# Altium project Puisance propre.PrjPcb
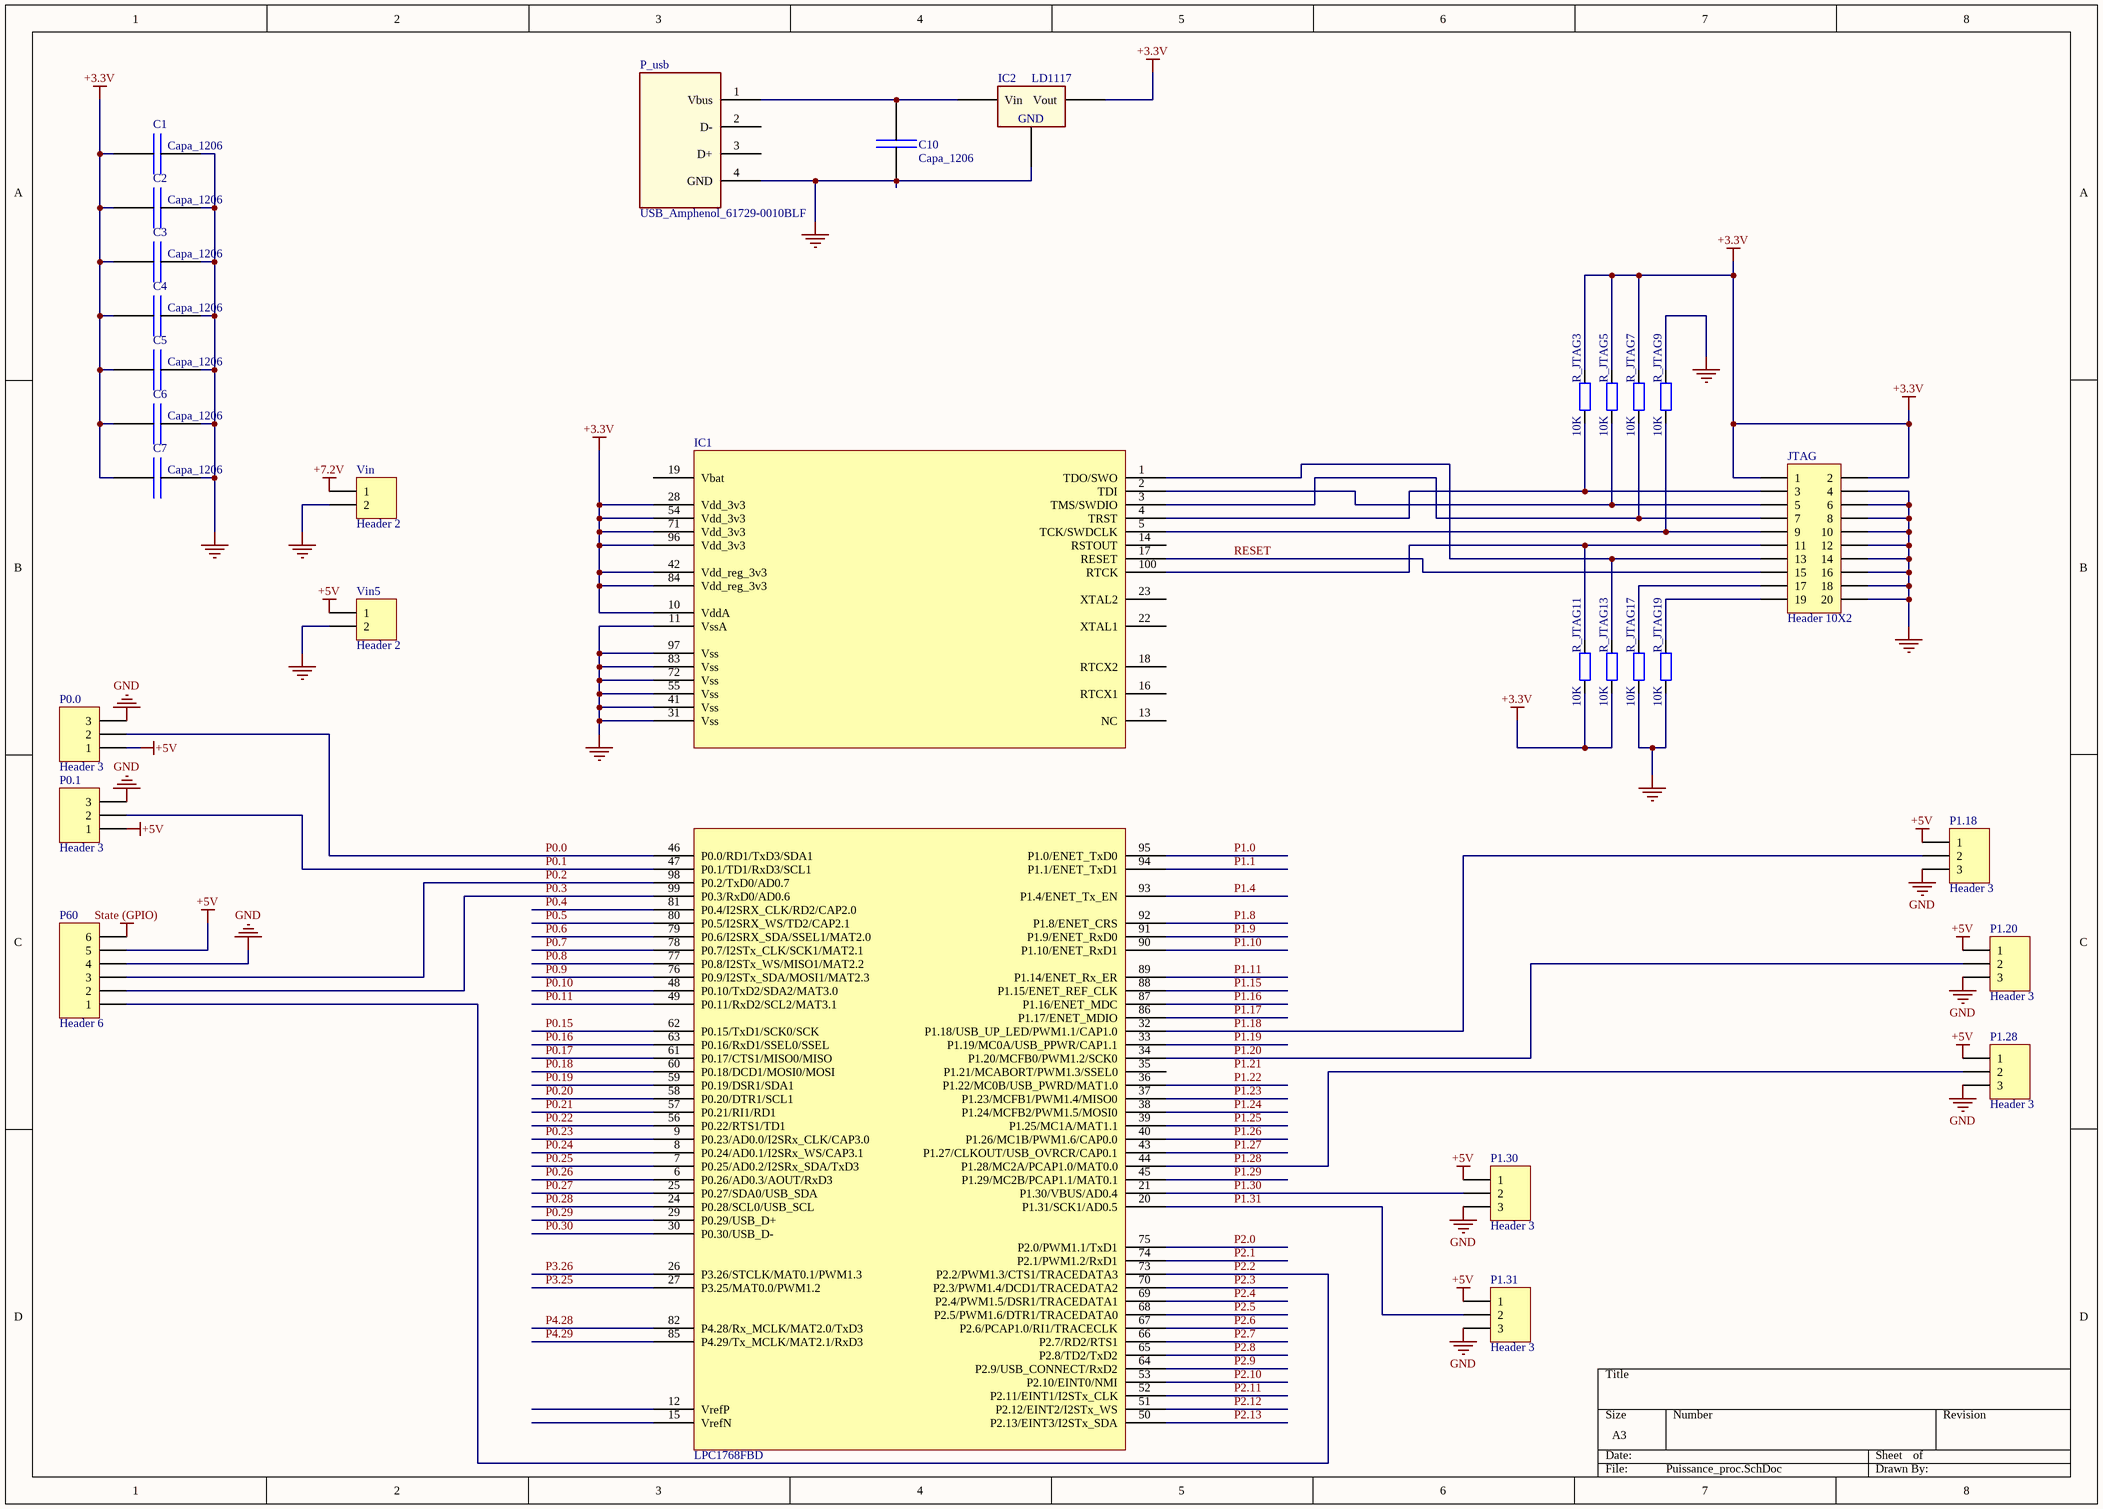
[diagram p0: Puissance_proc.SchDoc]
1 sheet, 30 parts. Net scope: global (net labels, ports and power ports of the same name join across sheets).
Board file: Carte_Puissance_V2.PcbDoc

## Sheet Puissance_proc.SchDoc
size A3; SheetNumber: 1; SheetTotal: 2

### Parts
C1  Capa_1206  [Res_1206]
C2  Capa_1206  [Res_1206]
C3  Capa_1206  [Res_1206]
C4  Capa_1206  [Res_1206]
C5  Capa_1206  [Res_1206]
C6  Capa_1206  [Res_1206]
C7  Capa_1206  [Res_1206]
C10  Capa_1206  [CC3216-1206]
IC1  LPC1768FBD  [F-QFP14X14-G100/Z17N]
IC2  LD1117  [SOT-223]
JTAG  Header 10X2  [HDR2X10]
P0.0  Header 3  [HDR1X3]
P0.1  Header 3  [HDR1X3]
P1.18  Header 3  [HDR1X3]
P1.20  Header 3  [HDR1X3]
P1.28  Header 3  [HDR1X3]
P1.30  Header 3  [HDR1X3]
P1.31  Header 3  [HDR1X3]
P60  Header 6  [HDR1X6]
P_usb  USB_Amphenol_61729-0010BLF  [USB_B_Amphenol_61729-0010BLF]
R_JTAG3  value 10K  [CR3216-1206]  (hidden comment: Res)
R_JTAG5  value 10K  [CR3216-1206]  (hidden comment: Res)
R_JTAG7  value 10K  [CR3216-1206]  (hidden comment: Res)
R_JTAG9  value 10K  [CR3216-1206]  (hidden comment: Res)
R_JTAG11  value 10K  [CR3216-1206]  (hidden comment: Res)
R_JTAG13  value 10K  [CR3216-1206]  (hidden comment: Res)
R_JTAG17  value 10K  [CR3216-1206]  (hidden comment: Res)
R_JTAG19  value 10K  [CR3216-1206]  (hidden comment: Res)
Vin  Header 2  [HDR1X2]
Vin5  Header 2  [HDR1X2]

### Nets
+3.3V: C1.2 C2.2 C3.2 C4.2 C5.2 C6.2 C7.2 IC1.10(VddA) IC1.28(Vdd_3v3) IC1.42(Vdd_reg_3v3) IC1.54(Vdd_3v3) IC1.71(Vdd_3v3) IC1.84(Vdd_reg_3v3) IC1.96(Vdd_3v3) IC2.2(Vout) JTAG.1 JTAG.2 R_JTAG3.1 R_JTAG5.1 R_JTAG7.1 R_JTAG11.2 R_JTAG13.2
+5V: P0.0.1 P0.1.1 P1.18.1 P1.20.1 P1.28.1 P1.30.1 P1.31.1 P60.5 Vin5.1
+7.2V: Vin.1
GND: C1.1 C2.1 C3.1 C4.1 C5.1 C6.1 C7.1 C10.2 IC1.11(VssA) IC1.31(Vss) IC1.41(Vss) IC1.55(Vss) IC1.72(Vss) IC1.83(Vss) IC1.97(Vss) IC2.1(GND) JTAG.4 JTAG.6 JTAG.8 JTAG.10 JTAG.12 JTAG.14 JTAG.16 JTAG.18 JTAG.20 P0.0.3 P0.1.3 P1.18.3 P1.20.3 P1.28.3 P1.30.3 P1.31.3 P60.4 P_usb.4(GND) R_JTAG9.1 R_JTAG17.2 R_JTAG19.2 Vin.2 Vin5.2
State (GPIO): P60.6
P0.0: IC1.46(P0.0/RD1/TxD3/SDA1) P0.0.2
P0.1: IC1.47(P0.1/TD1/RxD3/SCL1) P0.1.2
P0.2: IC1.98(P0.2/TxD0/AD0.7) P60.3
P0.3: IC1.99(P0.3/RxD0/AD0.6) P60.2
P0.4: IC1.81(P0.4/I2SRX_CLK/RD2/CAP2.0)
P0.5: IC1.80(P0.5/I2SRX_WS/TD2/CAP2.1)
P0.6: IC1.79(P0.6/I2SRX_SDA/SSEL1/MAT2.0)
P0.7: IC1.78(P0.7/I2STx_CLK/SCK1/MAT2.1)
P0.8: IC1.77(P0.8/I2STx_WS/MISO1/MAT2.2)
P0.9: IC1.76(P0.9/I2STx_SDA/MOSI1/MAT2.3)
P0.10: IC1.48(P0.10/TxD2/SDA2/MAT3.0)
P0.11: IC1.49(P0.11/RxD2/SCL2/MAT3.1)
P0.15: IC1.62(P0.15/TxD1/SCK0/SCK)
P0.16: IC1.63(P0.16/RxD1/SSEL0/SSEL)
P0.17: IC1.61(P0.17/CTS1/MISO0/MISO)
P0.18: IC1.60(P0.18/DCD1/MOSI0/MOSI)
P0.19: IC1.59(P0.19/DSR1/SDA1)
P0.20: IC1.58(P0.20/DTR1/SCL1)
P0.21: IC1.57(P0.21/RI1/RD1)
P0.22: IC1.56(P0.22/RTS1/TD1)
P0.23: IC1.9(P0.23/AD0.0/I2SRx_CLK/CAP3.0)
P0.24: IC1.8(P0.24/AD0.1/I2SRx_WS/CAP3.1)
P0.25: IC1.7(P0.25/AD0.2/I2SRx_SDA/TxD3)
P0.26: IC1.6(P0.26/AD0.3/AOUT/RxD3)
P0.27: IC1.25(P0.27/SDA0/USB_SDA)
P0.28: IC1.24(P0.28/SCL0/USB_SCL)
P0.29: IC1.29(P0.29/USB_D+)
P0.30: IC1.30(P0.30/USB_D-)
P1.0: IC1.95(P1.0/ENET_TxD0)
P1.1: IC1.94(P1.1/ENET_TxD1)
P1.4: IC1.93(P1.4/ENET_Tx_EN)
P1.8: IC1.92(P1.8/ENET_CRS)
P1.9: IC1.91(P1.9/ENET_RxD0)
P1.10: IC1.90(P1.10/ENET_RxD1)
P1.11: IC1.89(P1.14/ENET_Rx_ER)
P1.15: IC1.88(P1.15/ENET_REF_CLK)
P1.16: IC1.87(P1.16/ENET_MDC)
P1.17: IC1.86(P1.17/ENET_MDIO)
P1.18: IC1.32(P1.18/USB_UP_LED/PWM1.1/CAP1.0) P1.18.2
P1.19: IC1.33(P1.19/MC0A/USB_PPWR/CAP1.1)
P1.20: IC1.34(P1.20/MCFB0/PWM1.2/SCK0) P1.20.2
P1.22: IC1.36(P1.22/MC0B/USB_PWRD/MAT1.0)
P1.23: IC1.37(P1.23/MCFB1/PWM1.4/MISO0)
P1.24: IC1.38(P1.24/MCFB2/PWM1.5/MOSI0)
P1.25: IC1.39(P1.25/MC1A/MAT1.1)
P1.26: IC1.40(P1.26/MC1B/PWM1.6/CAP0.0)
P1.27: IC1.43(P1.27/CLKOUT/USB_OVRCR/CAP0.1)
P1.28: IC1.44(P1.28/MC2A/PCAP1.0/MAT0.0) P1.28.2
P1.29: IC1.45(P1.29/MC2B/PCAP1.1/MAT0.1)
P1.30: IC1.21(P1.30/VBUS/AD0.4) P1.30.2
P1.31: IC1.20(P1.31/SCK1/AD0.5) P1.31.2
P2.0: IC1.75(P2.0/PWM1.1/TxD1)
P2.1: IC1.74(P2.1/PWM1.2/RxD1)
P2.2: IC1.73(P2.2/PWM1.3/CTS1/TRACEDATA3) P60.1
P2.3: IC1.70(P2.3/PWM1.4/DCD1/TRACEDATA2)
P2.4: IC1.69(P2.4/PWM1.5/DSR1/TRACEDATA1)
P2.5: IC1.68(P2.5/PWM1.6/DTR1/TRACEDATA0)
P2.6: IC1.67(P2.6/PCAP1.0/RI1/TRACECLK)
P2.7: IC1.66(P2.7/RD2/RTS1)
P2.8: IC1.65(P2.8/TD2/TxD2)
P2.9: IC1.64(P2.9/USB_CONNECT/RxD2)
P2.10: IC1.53(P2.10/EINT0/NMI)
P2.11: IC1.52(P2.11/EINT1/I2STx_CLK)
P2.12: IC1.51(P2.12/EINT2/I2STx_WS)
P2.13: IC1.50(P2.13/EINT3/I2STx_SDA)
P3.25: IC1.27(P3.25/MAT0.0/PWM1.2)
P3.26: IC1.26(P3.26/STCLK/MAT0.1/PWM1.3)
P4.28: IC1.82(P4.28/Rx_MCLK/MAT2.0/TxD3)
P4.29: IC1.85(P4.29/Tx_MCLK/MAT2.1/RxD3)
RESET: IC1.17(RESET) JTAG.15
NetC10_1: C10.1 IC2.3(Vin) P_usb.1(Vbus)
NetIC1_1: IC1.1(TDO/SWO) JTAG.13 R_JTAG13.1
NetIC1_2: IC1.2(TDI) JTAG.5 R_JTAG5.2
NetIC1_3: IC1.3(TMS/SWDIO) JTAG.7 R_JTAG7.2
NetIC1_4: IC1.4(TRST) JTAG.3 R_JTAG3.2
NetIC1_5: IC1.5(TCK/SWDCLK) JTAG.9 R_JTAG9.2
NetIC1_100: IC1.100(RTCK) JTAG.11 R_JTAG11.1
NetJTAG_17: JTAG.17 R_JTAG17.1
NetJTAG_19: JTAG.19 R_JTAG19.1

Not connected (* = marked no-connect by the designer): IC1 12(VrefP) 13(NC) 14(RSTOUT) 15(VrefN) 16(RTCX1) 18(RTCX2) 19(Vbat) 22(XTAL1) 23(XTAL2) 35(P1.21/MCABORT/PWM1.3/SSEL0); P_usb 2(D-) 3(D+)

### Notes on the sheet
- Labels drawn without touching a wire or pin: P1.21

### Library data of the parts
IC1 = LPC1768FBD: NXP Cortex M3 LPC1768
IC2 = LD1117: PAD a Vout
JTAG = Header 10X2: Header, 10-Pin, Dual row; LatestRevisionDate: 17-Jul-2002; LatestRevisionNote: Re-released for DXP Platform.; Publisher: Altium Limited
P0.0 P0.1 P1.18 P1.20 P1.28 P1.30 P1.31 = Header 3: Header, 3-Pin; LatestRevisionDate: 17-Jul-2002; LatestRevisionNote: Re-released for DXP Platform.; Publisher: Altium Limited
P60 = Header 6: Header, 6-Pin; LatestRevisionDate: 17-Jul-2002; LatestRevisionNote: Re-released for DXP Platform.; Publisher: Altium Limited
P_usb = USB_Amphenol_61729-0010BLF: 61729-0010BLF Farnell 1097897
R_JTAG3 R_JTAG5 R_JTAG7 R_JTAG9 R_JTAG11 R_JTAG13 R_JTAG17 R_JTAG19 = Res: Resistance; Published: 8-Jun-2000; Revision: July-2002: Re-released for DXP Platform.; Publisher: Altium Limited
Vin Vin5 = Header 2: Header, 2-Pin; LatestRevisionDate: 17-Jul-2002; LatestRevisionNote: Re-released for DXP Platform.; Publisher: Altium Limited